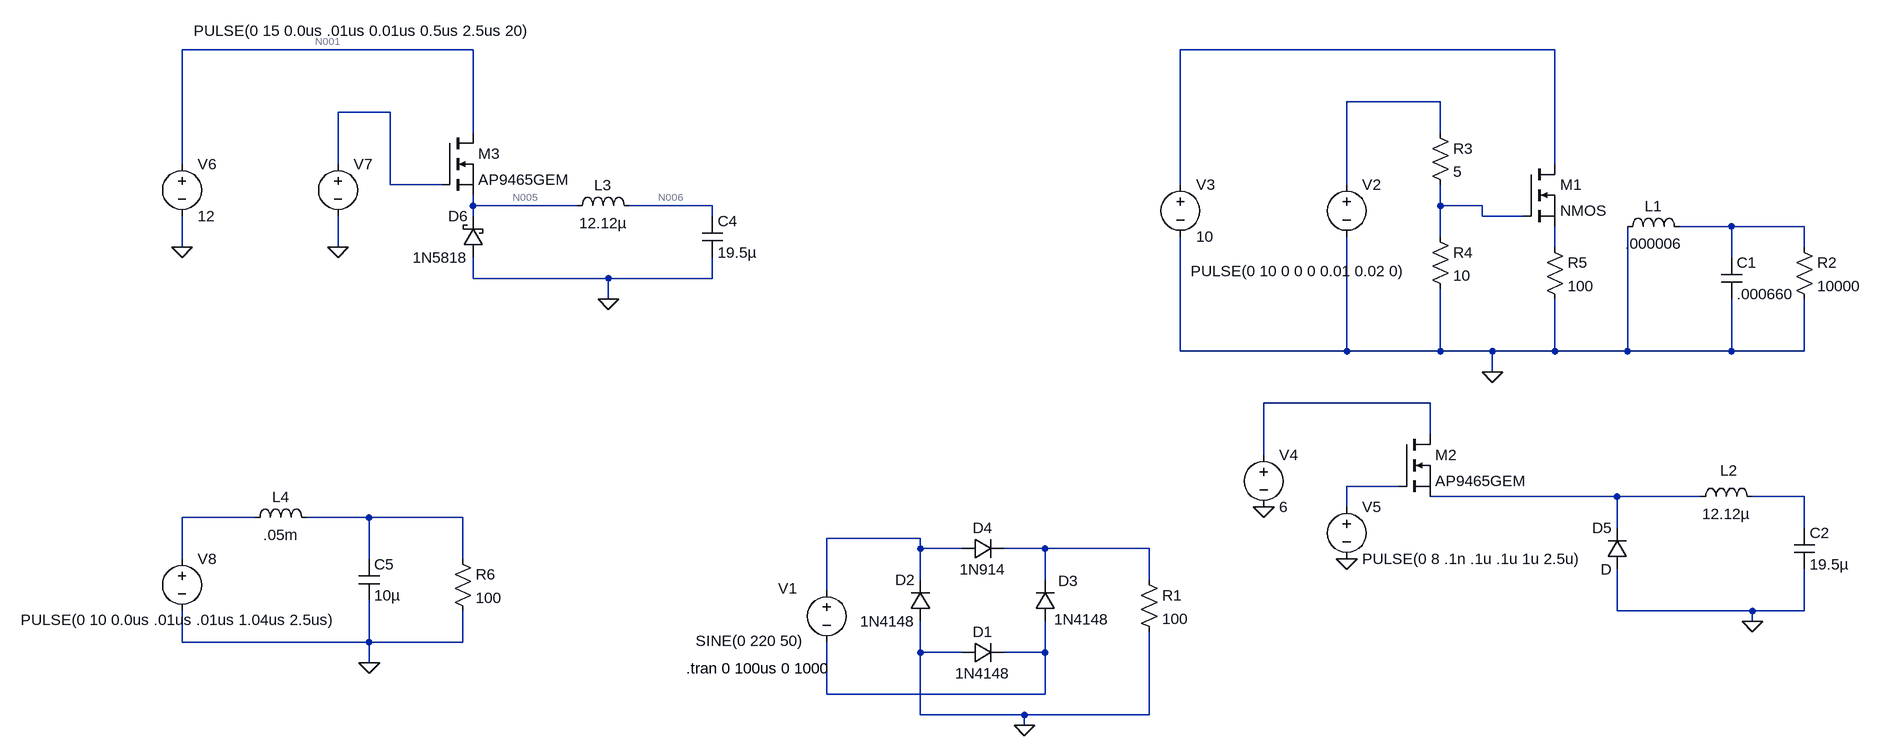
[diagram p0: schematic circuit_ver1.5.4.asc]
circuit_ver1.5.4.asc, the LTspice schematic file:
Version 4
SHEET 1 880 680
WIRE -1792 -720 -2240 -720
WIRE -128 -720 -704 -720
WIRE -304 -640 -448 -640
WIRE -1920 -624 -2000 -624
WIRE -1792 -592 -1792 -720
WIRE -304 -592 -304 -640
WIRE -2240 -544 -2240 -720
WIRE -2000 -544 -2000 -624
WIRE -128 -544 -128 -720
WIRE -1920 -512 -1920 -624
WIRE -1840 -512 -1920 -512
WIRE -704 -512 -704 -720
WIRE -448 -512 -448 -640
WIRE -1792 -480 -1792 -496
WIRE -1632 -480 -1792 -480
WIRE -1424 -480 -1552 -480
WIRE -304 -480 -304 -512
WIRE -240 -480 -304 -480
WIRE -1792 -464 -1792 -480
WIRE -1424 -464 -1424 -480
WIRE -240 -464 -240 -480
WIRE -176 -464 -240 -464
WIRE 144 -448 64 -448
WIRE 256 -448 144 -448
WIRE -304 -432 -304 -480
WIRE -2240 -416 -2240 -464
WIRE -2000 -416 -2000 -464
WIRE -128 -416 -128 -448
WIRE 256 -416 256 -448
WIRE 144 -400 144 -448
WIRE -1792 -368 -1792 -400
WIRE -1584 -368 -1792 -368
WIRE -1424 -368 -1424 -400
WIRE -1424 -368 -1584 -368
WIRE -1584 -336 -1584 -368
WIRE -704 -256 -704 -432
WIRE -448 -256 -448 -432
WIRE -448 -256 -704 -256
WIRE -304 -256 -304 -352
WIRE -304 -256 -448 -256
WIRE -224 -256 -304 -256
WIRE -128 -256 -128 -336
WIRE -128 -256 -224 -256
WIRE -16 -256 -16 -448
WIRE -16 -256 -128 -256
WIRE 144 -256 144 -336
WIRE 144 -256 -16 -256
WIRE 256 -256 256 -336
WIRE 256 -256 144 -256
WIRE -224 -224 -224 -256
WIRE -320 -176 -576 -176
WIRE -320 -128 -320 -176
WIRE -576 -96 -576 -176
WIRE -368 -48 -448 -48
WIRE -32 -32 -320 -32
WIRE 96 -32 -32 -32
WIRE 256 -32 176 -32
WIRE -448 -16 -448 -48
WIRE -2128 0 -2240 0
WIRE -1952 0 -2048 0
WIRE -1808 0 -1952 0
WIRE -32 16 -32 -32
WIRE 256 16 256 -32
WIRE -1104 32 -1248 32
WIRE -1104 48 -1104 32
WIRE -1040 48 -1104 48
WIRE -912 48 -976 48
WIRE -752 48 -912 48
WIRE -2240 64 -2240 0
WIRE -1952 64 -1952 0
WIRE -1808 64 -1808 0
WIRE -1104 96 -1104 48
WIRE -912 96 -912 48
WIRE -752 96 -752 48
WIRE -1248 112 -1248 32
WIRE -32 144 -32 80
WIRE 176 144 -32 144
WIRE 256 144 256 80
WIRE 256 144 176 144
WIRE 176 160 176 144
WIRE -2240 192 -2240 144
WIRE -1952 192 -1952 128
WIRE -1952 192 -2240 192
WIRE -1808 192 -1808 144
WIRE -1808 192 -1952 192
WIRE -1104 208 -1104 160
WIRE -1040 208 -1104 208
WIRE -912 208 -912 160
WIRE -912 208 -976 208
WIRE -1952 224 -1952 192
WIRE -1248 272 -1248 192
WIRE -912 272 -912 208
WIRE -912 272 -1248 272
WIRE -1104 304 -1104 208
WIRE -944 304 -1104 304
WIRE -752 304 -752 176
WIRE -752 304 -944 304
WIRE -944 320 -944 304
FLAG -944 320 0
FLAG -224 -224 0
FLAG 176 160 0
FLAG -576 -16 0
FLAG -448 64 0
FLAG -2240 -416 0
FLAG -2000 -416 0
FLAG -1584 -336 0
FLAG -1952 224 0
SYMBOL voltage -1248 96 R0
WINDOW 3 -202 94 Left 2
WINDOW 123 0 0 Left 2
WINDOW 39 0 0 Left 2
WINDOW 0 -75 13 Left 2
SYMATTR Value SINE(0 220 50)
SYMATTR InstName V1
SYMBOL diode -1040 224 R270
WINDOW 0 32 32 VTop 2
WINDOW 3 0 32 VBottom 2
SYMATTR InstName D1
SYMATTR Value 1N4148
SYMBOL diode -1088 160 R180
WINDOW 0 24 64 Left 2
WINDOW 3 24 0 Left 2
SYMATTR InstName D2
SYMATTR Value 1N4148
SYMBOL diode -896 160 R180
WINDOW 0 -35 62 Left 2
WINDOW 3 -83 3 Left 2
SYMATTR InstName D3
SYMATTR Value 1N4148
SYMBOL diode -1040 64 R270
WINDOW 0 32 32 VTop 2
WINDOW 3 0 32 VBottom 2
SYMATTR InstName D4
SYMATTR Value 1N914
SYMBOL res -768 80 R0
SYMATTR InstName R1
SYMATTR Value 100
SYMBOL voltage -448 -528 R0
WINDOW 3 91 149 Right 2
WINDOW 123 0 0 Left 2
WINDOW 39 0 0 Left 2
SYMATTR Value PULSE(0 10 0 0 0 0.01 0.02 0)
SYMATTR InstName V2
SYMBOL nmos -176 -544 R0
SYMATTR InstName M1
SYMBOL res 240 -432 R0
SYMATTR InstName R2
SYMATTR Value 10000
SYMBOL res -320 -608 R0
SYMATTR InstName R3
SYMATTR Value 5
SYMBOL res -320 -448 R0
SYMATTR InstName R4
SYMATTR Value 10
SYMBOL voltage -704 -528 R0
WINDOW 123 0 0 Left 2
WINDOW 39 0 0 Left 2
SYMATTR InstName V3
SYMATTR Value 10
SYMBOL ind -32 -432 R270
WINDOW 0 32 56 VTop 2
WINDOW 3 5 56 VBottom 2
SYMATTR InstName L1
SYMATTR Value .000006
SYMBOL cap 128 -400 R0
SYMATTR InstName C1
SYMATTR Value .000660
SYMATTR SpiceLine V=50
SYMBOL res -144 -432 R0
SYMATTR InstName R5
SYMATTR Value 100
SYMBOL ind 80 -16 R270
WINDOW 0 41 60 VTop 2
WINDOW 3 5 56 VBottom 2
SYMATTR InstName L2
SYMATTR Value 12.12µ
SYMATTR SpiceLine Rser=0.001
SYMBOL cap 240 16 R0
SYMATTR InstName C2
SYMATTR Value 19.5µ
SYMBOL nmos -368 -128 R0
SYMATTR InstName M2
SYMATTR Value AP9465GEM
SYMBOL voltage -576 -112 R0
WINDOW 123 0 0 Left 2
WINDOW 39 0 0 Left 2
SYMATTR InstName V4
SYMATTR Value 6
SYMBOL voltage -448 -32 R0
WINDOW 123 0 0 Left 2
WINDOW 39 0 0 Left 2
SYMATTR InstName V5
SYMATTR Value PULSE(0 8 .1n .1u .1u 1u 2.5u)
SYMBOL diode -16 80 R180
WINDOW 0 24 64 Left 2
WINDOW 3 24 0 Left 2
SYMATTR InstName D5
SYMBOL nmos -1840 -592 R0
SYMATTR InstName M3
SYMATTR Value AP9465GEM
SYMBOL voltage -2240 -560 R0
WINDOW 123 0 0 Left 2
WINDOW 39 0 0 Left 2
SYMATTR InstName V6
SYMATTR Value 12
SYMBOL voltage -2000 -560 R0
WINDOW 3 -222 -189 Left 2
WINDOW 123 0 0 Left 2
WINDOW 39 0 0 Left 2
SYMATTR InstName V7
SYMATTR Value PULSE(0 15 0.0us .01us 0.01us 0.5us 2.5us 20)
SYMBOL schottky -1776 -400 R180
WINDOW 0 24 64 Left 2
WINDOW 3 24 0 Left 2
SYMATTR InstName D6
SYMATTR Value 1N5818
SYMATTR Description Diode
SYMATTR Type diode
SYMBOL ind -1648 -464 R270
WINDOW 0 32 56 VTop 2
WINDOW 3 5 56 VBottom 2
SYMATTR InstName L3
SYMATTR Value 12.12µ
SYMBOL cap -1440 -464 R0
SYMATTR InstName C4
SYMATTR Value 19.5µ
SYMBOL ind -2144 16 R270
WINDOW 0 32 56 VTop 2
WINDOW 3 5 56 VBottom 2
SYMATTR InstName L4
SYMATTR Value .05m
SYMBOL cap -1968 64 R0
SYMATTR InstName C5
SYMATTR Value 10µ
SYMBOL voltage -2240 48 R0
WINDOW 3 -248 110 Left 2
WINDOW 123 0 0 Left 2
WINDOW 39 0 0 Left 2
SYMATTR InstName V8
SYMATTR Value PULSE(0 10 0.0us .01us .01us 1.04us 2.5us)
SYMBOL res -1824 48 R0
SYMATTR InstName R6
SYMATTR Value 100
TEXT -1464 232 Left 2 !.tran 0 100us 0 1000

The netlist it stands for:
* circuit_ver1.5.4.asc
V1 N016 N018 SINE(0 220 50)
D1 0 N018 1N4148
D2 0 N016 1N4148
D3 N018 N017 1N4148
D4 N016 N017 1N914
R1 N017 0 100
V2 N003 0 PULSE(0 10 0 0 0 0.01 0.02 0)
M1 N002 N007 N009 N009 NMOS
R2 N008 0 10000
R3 N003 N007 5
R4 N007 0 10
V3 N002 0 10
L1 0 N008 .000006
C1 N008 0 .000660 V=50
R5 N009 0 100
L2 N012 N013 12.12µ Rser=0.001
C2 N013 0 19.5µ
M2 N010 N011 N012 N012 AP9465GEM
V4 N010 0 6
V5 N011 0 PULSE(0 8 .1n .1u .1u 1u 2.5u)
D5 0 N012 D
M3 N001 N004 N005 N005 AP9465GEM
V6 N001 0 12
V7 N004 0 PULSE(0 15 0.0us .01us 0.01us 0.5us 2.5us 20)
D6 0 N005 1N5818
L3 N005 N006 12.12µ
C4 N006 0 19.5µ
L4 N014 N015 .05m
C5 N015 0 10µ
V8 N014 0 PULSE(0 10 0.0us .01us .01us 1.04us 2.5us)
R6 N015 0 100
.model D D
.lib standard.dio
.model NMOS NMOS
.model PMOS PMOS
.lib standard.mos
.tran 0 100us 0 1000
.backanno
.end

* Results of the author's LTspice run, read from the files saved beside the schematic
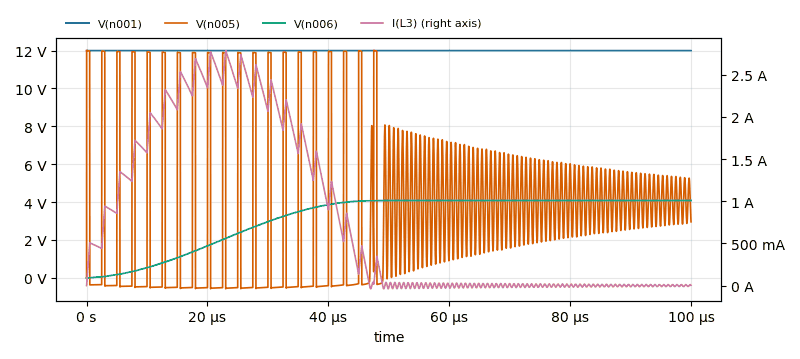
[diagram p1: Transient Analysis of circuit_ver1.5.4.asc, plotted from the saved traces]
* Transient Analysis, 1 run:
*   V(n001): min 12 V, max 12 V, average 12 V, rms 12 V, last 12 V
*   V(n005): min -576.9 mV, max 12.01 V, average 3.153 V, rms 4.98 V, last 2.959 V
*   V(n006): min 0 V, max 4.085 V, average 3.154 V, rms 3.445 V, last 4.085 V
*   I(L3): min -38.08 mA, max 2.788 A, average 796.6 mA, rms 1.272 A, last 3.996 mA